# EAGLE schematic Bmp180Shield (EAGLE 7.4.0)
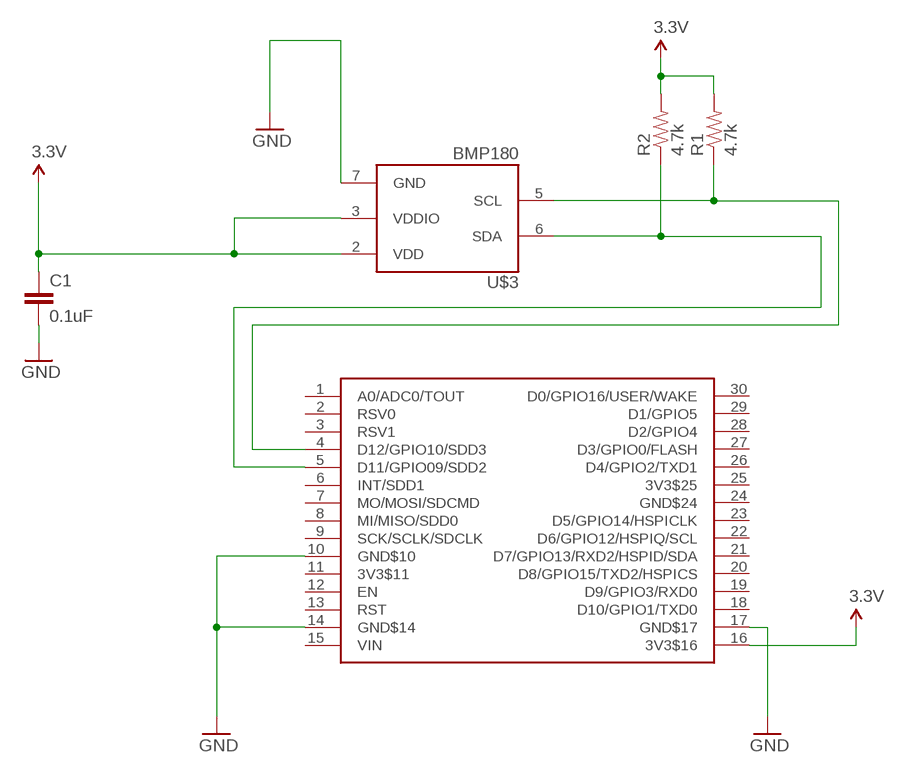
[diagram p0: schematic, sheet 1]

## Parts
C1  0.1uF  CAP0402-CAP  [0402-CAP]
R1  4.7k  RESISTOR0402-RES  [0402-RES]
R2  4.7k  RESISTOR0402-RES  [0402-RES]
U$1  NERDSHIELD  [NERDUINO_STACK]
U$3  BMP180  [BMP180]

## Nets
3.3V: C1.1 R1.2 R2.2 U$1.16(3V3$16) U$3.2(VDD) U$3.3(VDDIO)
GND: C1.2 U$1.10(GND$10) U$1.14(GND$14) U$1.17(GND$17) U$3.7(GND)
N$2: R2.1 U$1.5(D11/GPIO09/SDD2) U$3.6(SDA)
N$3: R1.1 U$1.4(D12/GPIO10/SDD3) U$3.5(SCL)
Unconnected: U$1.1(A0/ADC0/TOUT) U$1.2(RSV0) U$1.3(RSV1) U$1.6(INT/SDD1) U$1.7(MO/MOSI/SDCMD) U$1.8(MI/MISO/SDD0) U$1.9(SCK/SCLK/SDCLK) U$1.11(3V3$11) U$1.12(EN) U$1.13(RST) U$1.15(VIN) U$1.18(D10/GPIO1/TXD0) U$1.19(D9/GPIO3/RXD0) U$1.20(D8/GPIO15/TXD2/HSPICS) U$1.21(D7/GPIO13/RXD2/HSPID/SDA) U$1.22(D6/GPIO12/HSPIQ/SCL) U$1.23(D5/GPIO14/HSPICLK) U$1.24(GND$24) U$1.25(3V3$25) U$1.26(D4/GPIO2/TXD1) U$1.27(D3/GPIO0/FLASH) U$1.28(D2/GPIO4) U$1.29(D1/GPIO5) U$1.30(D0/GPIO16/USER/WAKE)

## Library data of the parts
C1 = SparkFun:CAP: Capacitor Standard 0603 ceramic capacitor, and 0.1" leaded capacitor.
R1 R2 = SparkFun:RESISTOR: Resistor Basic schematic elements and footprints for 0603, 1206, and PTH resistors.
U$1 = NerduinoShieldLib:NERDSHIELD
U$3 = SparkFun-Sensors:BMP180: BOSCH BMP180 DIGITAL BAROMETRIC PRESSURE SENSOR Web page: http://www.bosch-sensortec.com/en/homepage/products_3/environmental_sensors_1/bmp180_1/bmp180 Datasheet: http://ae-bst.resource.bosch.com/media/products/dokumente/bmp180/BST-BMP180-DS000-09.pdf The BMP180 is the function compatible successor of the BMP085, a new generation of high precision digital pressure sensors for consumer applications. The ultra-low power, low voltage electronics of the BMP180 is optimized for use in mobile phones, PDAs, GPS navigation devices and outdoor equipment. With a low altitude noise of merely 0.25m at fast conversion time, the BMP180 offers superior performance. The I2C interface allows for easy system integration with a microcontroller. The BMP180 is based on piezo-resistive technology for EMC robustness, high accuracy and linearity as well as long term stability. Key features: - Temperature measurement included - I2C interface - Fully calibrated - Pb-free, halogen-free and RoHS compliant, - MSL 1 Basic specs: Pressure range: 300 to 1100hPa (+9000m to -500m relating to sea level) Supply voltage: 1.8 to 3.6V (VDD), 1.62V to 3.6V (VDDIO) Package: LGA package with metal lid Small footprint: 3.6mm x 3.8mm Super-flat: 0.93mm height Low power: 5μA at 1 sample / sec. in standard mode Low noise: 0.06hPa (0.5m) in ultra low power mode, 0.02hPa (0.17m) advanced resolution mode Typical applications: - Enhancement of GPS navigation (dead-reckoning, slope detection, etc.) - In- and out-door navigation - Leisure and sports - Weather forecast - Vertical velocity indication (rise/sink speed)